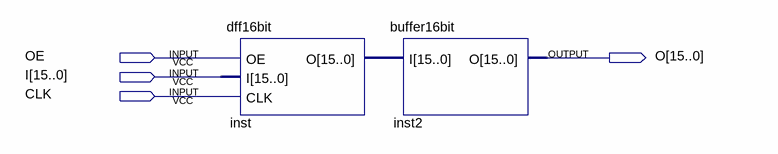
[diagram p0: schematic sheet]
// Quartus schematic reg16.bdf as structural Verilog: 2 symbols, 4 pins
module reg16 (
  input  OE,
  input  [15:0] I,
  input  CLK,
  output [15:0] O
);

  wire [15:0] inst_o;

  dff16bit inst (.OE(OE), .I(I), .CLK(CLK), .O(inst_o));
  buffer16bit inst2 (.I(inst_o), .O(O));
endmodule
